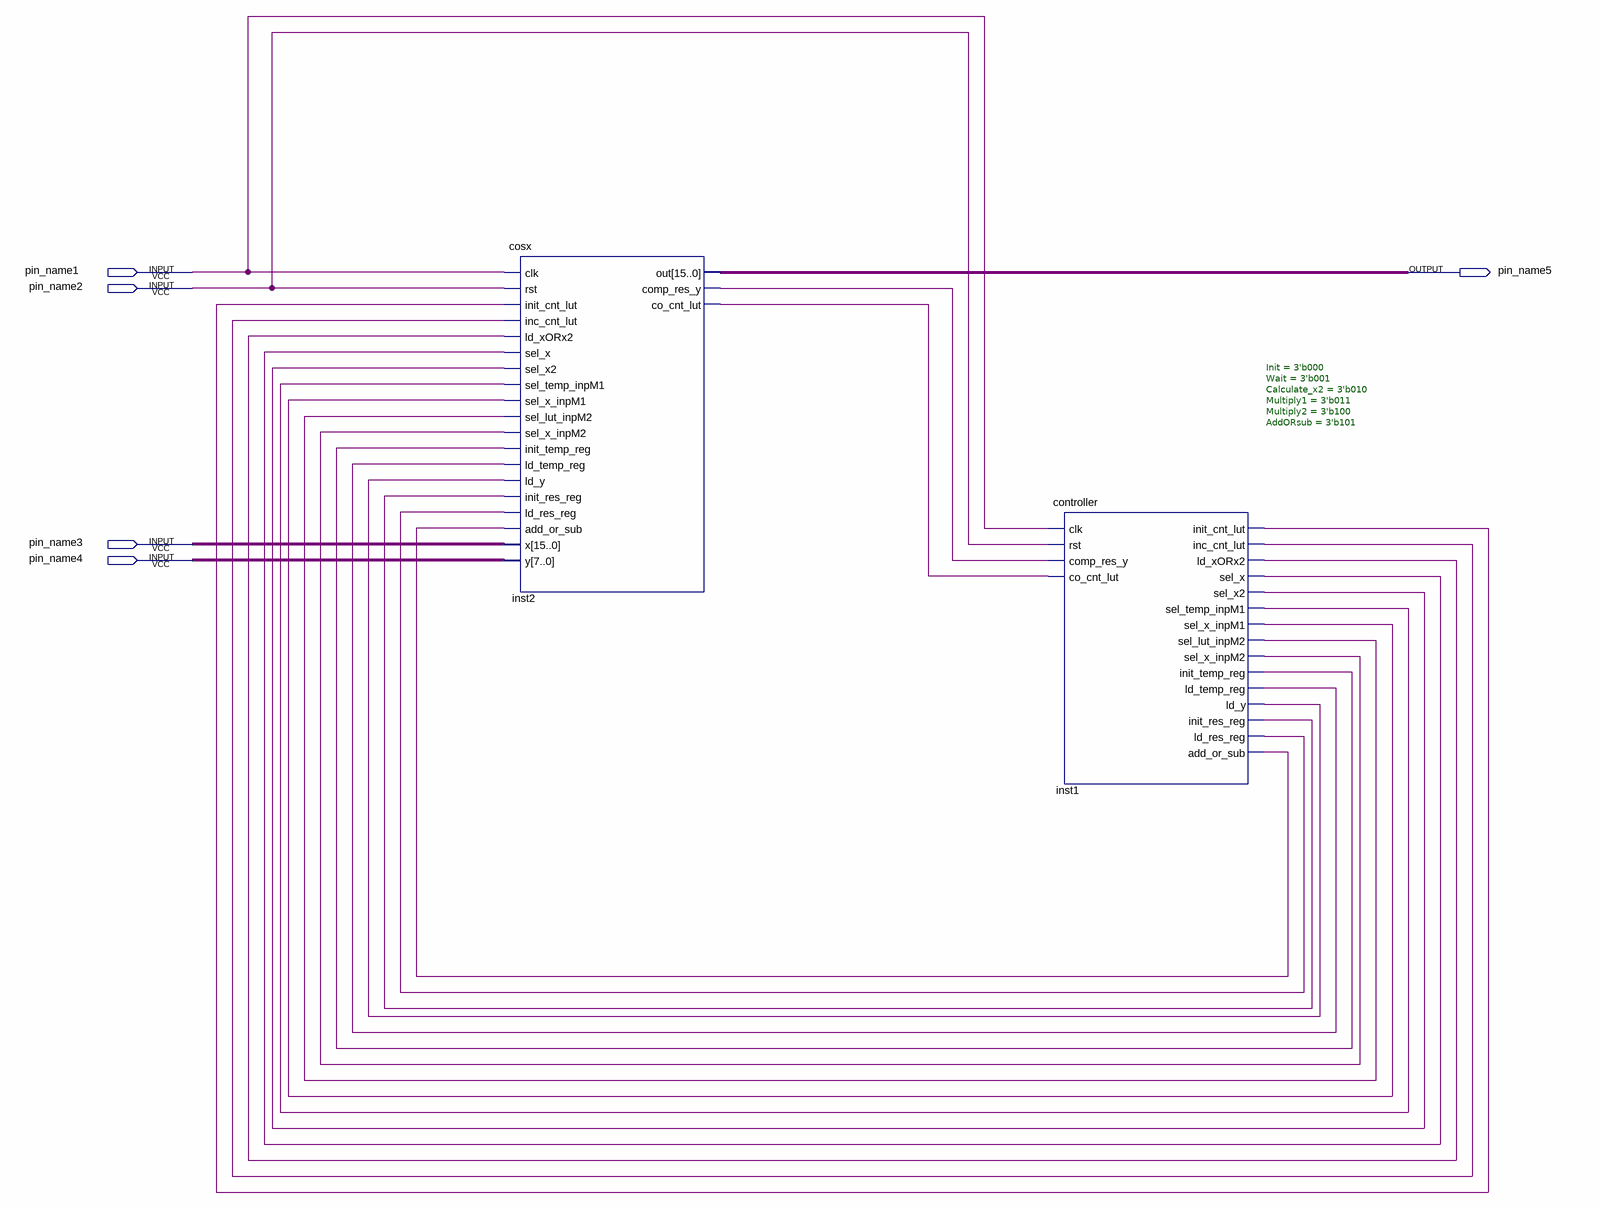
[diagram p0: schematic sheet]
// Quartus schematic Block1.bdf as structural Verilog: 2 symbols, 5 pins
module Block1 (
  input  pin_name1,
  input  pin_name2,
  input  pin_name3,
  input  pin_name4,
  output pin_name5
);

  wire inst1_add_or_sub, inst1_inc_cnt_lut, inst1_init_cnt_lut, inst1_init_res_reg, inst1_init_temp_reg,
       inst1_ld_res_reg, inst1_ld_temp_reg, inst1_ld_xorx2, inst1_ld_y, inst1_sel_lut_inpm2,
       inst1_sel_temp_inpm1, inst1_sel_x, inst1_sel_x2, inst1_sel_x_inpm1, inst1_sel_x_inpm2,
       inst2_co_cnt_lut, inst2_comp_res_y;
  wire [7:0] undriven_2;
  wire [15:0] inst2_out, undriven;

  cosx inst2 (
    .clk(pin_name1), .rst(pin_name2), .init_cnt_lut(inst1_init_cnt_lut), .inc_cnt_lut(inst1_inc_cnt_lut),
    .ld_xORx2(inst1_ld_xorx2), .sel_x(inst1_sel_x), .sel_x2(inst1_sel_x2),
    .sel_temp_inpM1(inst1_sel_temp_inpm1), .sel_x_inpM1(inst1_sel_x_inpm1),
    .sel_lut_inpM2(inst1_sel_lut_inpm2), .sel_x_inpM2(inst1_sel_x_inpm2),
    .init_temp_reg(inst1_init_temp_reg), .ld_temp_reg(inst1_ld_temp_reg), .ld_y(inst1_ld_y),
    .init_res_reg(inst1_init_res_reg), .ld_res_reg(inst1_ld_res_reg), .add_or_sub(inst1_add_or_sub),
    .x(undriven), .y(undriven_2), .out(inst2_out), .comp_res_y(inst2_comp_res_y),
    .co_cnt_lut(inst2_co_cnt_lut));
  controller #(.Init(3'b000), .Wait(3'b001), .Calculate_x2(3'b010), .Multiply1(3'b011), .Multiply2(3'b100), .AddORsub(3'b101)) inst1 (
    .clk(pin_name1), .rst(pin_name2), .comp_res_y(inst2_comp_res_y), .co_cnt_lut(inst2_co_cnt_lut),
    .init_cnt_lut(inst1_init_cnt_lut), .inc_cnt_lut(inst1_inc_cnt_lut), .ld_xORx2(inst1_ld_xorx2),
    .sel_x(inst1_sel_x), .sel_x2(inst1_sel_x2), .sel_temp_inpM1(inst1_sel_temp_inpm1),
    .sel_x_inpM1(inst1_sel_x_inpm1), .sel_lut_inpM2(inst1_sel_lut_inpm2), .sel_x_inpM2(inst1_sel_x_inpm2),
    .init_temp_reg(inst1_init_temp_reg), .ld_temp_reg(inst1_ld_temp_reg), .ld_y(inst1_ld_y),
    .init_res_reg(inst1_init_res_reg), .ld_res_reg(inst1_ld_res_reg), .add_or_sub(inst1_add_or_sub));
endmodule
